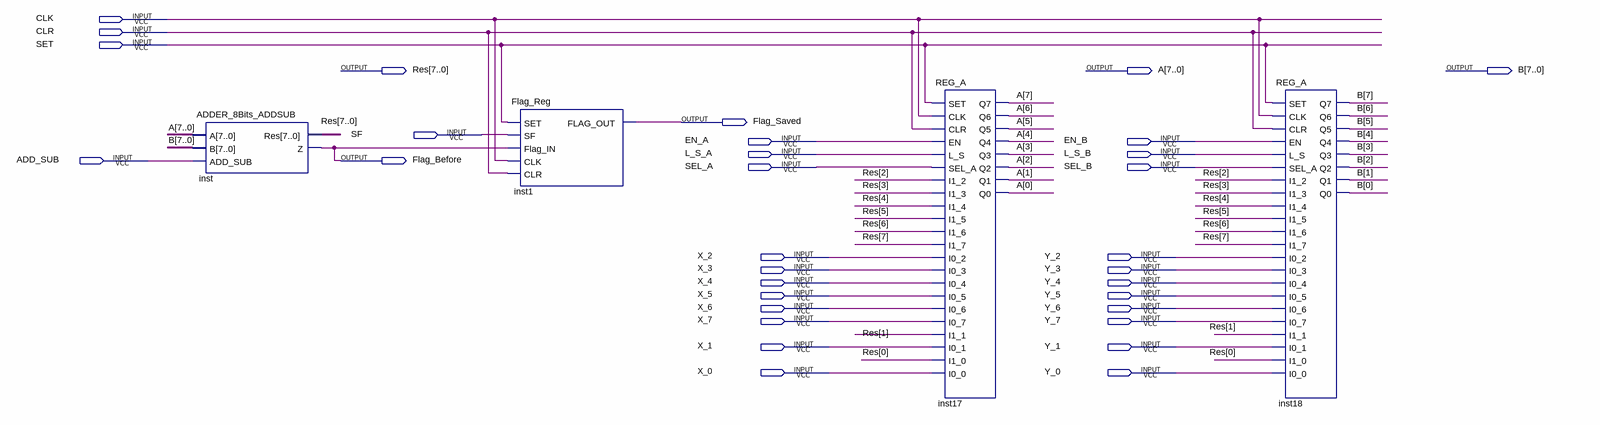
[diagram p0: schematic sheet]
// Quartus schematic DataPath.bdf as structural Verilog: 4 symbols, 32 pins
module DataPath (
  input  CLK,
  input  CLR,
  input  SET,
  input  SF,
  input  EN_A,
  input  EN_B,
  input  L_S_A,
  input  L_S_B,
  input  ADD_SUB,
  input  SEL_A,
  input  SEL_B,
  input  X_2,
  input  Y_2,
  input  X_3,
  input  Y_3,
  input  X_4,
  input  Y_4,
  input  X_5,
  input  Y_5,
  input  X_6,
  input  Y_6,
  input  X_7,
  input  Y_7,
  input  X_1,
  input  Y_1,
  input  X_0,
  input  Y_0,
  output [7:0] Res,
  output [7:0] A,
  output [7:0] B,
  output Flag_Saved,
  output Flag_Before
);

  ADDER_8Bits_ADDSUB inst (.A(A), .B(B), .ADD_SUB(ADD_SUB), .Res(Res), .Z(Flag_Before));
  Flag_Reg inst1 (.SET(SET), .SF(SF), .Flag_IN(Flag_Before), .CLK(CLK), .CLR(CLR), .FLAG_OUT(Flag_Saved));
  REG_A inst17 (
    .SET(SET), .CLK(CLK), .CLR(CLR), .EN(EN_A), .L_S(L_S_A), .SEL_A(SEL_A), .I1_2(Res[2]), .I1_3(Res[3]),
    .I1_4(Res[4]), .I1_5(Res[5]), .I1_6(Res[6]), .I1_7(Res[7]), .I0_2(X_2), .I0_3(X_3), .I0_4(X_4),
    .I0_5(X_5), .I0_6(X_6), .I0_7(X_7), .I1_1(Res[1]), .I0_1(X_1), .I1_0(Res[0]), .I0_0(X_0), .Q7(A[7]),
    .Q6(A[6]), .Q5(A[5]), .Q4(A[4]), .Q3(A[3]), .Q2(A[2]), .Q1(A[1]), .Q0(A[0]));
  REG_A inst18 (
    .SET(SET), .CLK(CLK), .CLR(CLR), .EN(EN_B), .L_S(L_S_B), .SEL_A(SEL_B), .I1_2(Res[2]), .I1_3(Res[3]),
    .I1_4(Res[4]), .I1_5(Res[5]), .I1_6(Res[6]), .I1_7(Res[7]), .I0_2(Y_2), .I0_3(Y_3), .I0_4(Y_4),
    .I0_5(Y_5), .I0_6(Y_6), .I0_7(Y_7), .I1_1(Res[1]), .I0_1(Y_1), .I1_0(Res[0]), .I0_0(Y_0), .Q7(B[7]),
    .Q6(B[6]), .Q5(B[5]), .Q4(B[4]), .Q3(B[3]), .Q2(B[2]), .Q1(B[1]), .Q0(B[0]));
endmodule
